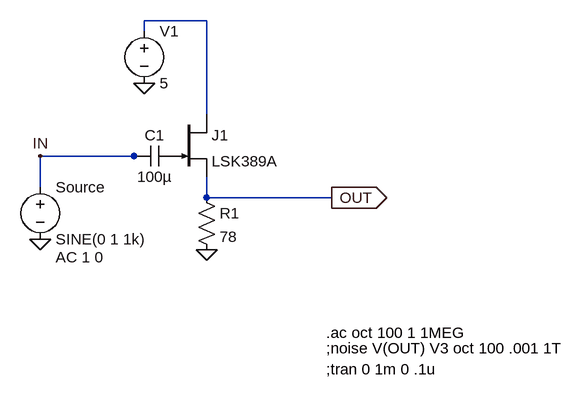
[diagram p0: schematic ltspice-jfet-follower.asc]
ltspice-jfet-follower.asc, the LTspice schematic file:
Version 4
SHEET 1 2344 2032
WIRE 800 1200 704 1200
WIRE 704 1216 704 1200
WIRE 800 1344 800 1200
WIRE 688 1408 544 1408
WIRE 704 1408 688 1408
WIRE 544 1456 544 1408
WIRE 800 1472 800 1440
WIRE 992 1472 800 1472
FLAG 992 1472 OUT
IOPIN 992 1472 Out
FLAG 800 1552 0
FLAG 704 1296 0
FLAG 544 1536 0
FLAG 544 1408 IN
SYMBOL njf 752 1344 R0
SYMATTR InstName J1
SYMATTR Value LSK389A
SYMBOL res 784 1456 R0
SYMATTR InstName R1
SYMATTR Value 78
SYMBOL voltage 704 1200 R0
WINDOW 39 0 0 Left 0
SYMATTR Value2 AC 1 0
SYMATTR InstName V1
SYMATTR Value 5
SYMBOL cap 752 1392 R90
WINDOW 0 0 32 VBottom 2
WINDOW 3 32 32 VTop 2
SYMATTR InstName C1
SYMATTR Value 100µ
SYMBOL voltage 544 1440 R0
WINDOW 39 0 0 Left 0
WINDOW 123 24 124 Left 2
SYMATTR Value2 AC 1 0
SYMATTR InstName Source
SYMATTR Value SINE(0 1 1k)
TEXT 984 1736 Left 2 !;tran 0 1m 0 .1u
TEXT 984 1704 Left 2 !;noise V(OUT) V3 oct 100 .001 1T
TEXT 984 1680 Left 2 !.ac oct 100 1 1MEG

The netlist it stands for:
* ltspice-jfet-follower.asc
J1 N001 P001 OUT LSK389A
R1 OUT 0 78
V1 N001 0 5 AC 1 0
C1 P001 IN 100µ
V§Source IN 0 SINE(0 1 1k) AC 1 0
.model NJF NJF
.model PJF PJF
.lib standard.jft
;tran 0 1m 0 .1u
;noise V(OUT) V3 oct 100 .001 1T
.ac oct 100 1 1MEG
.backanno
.end